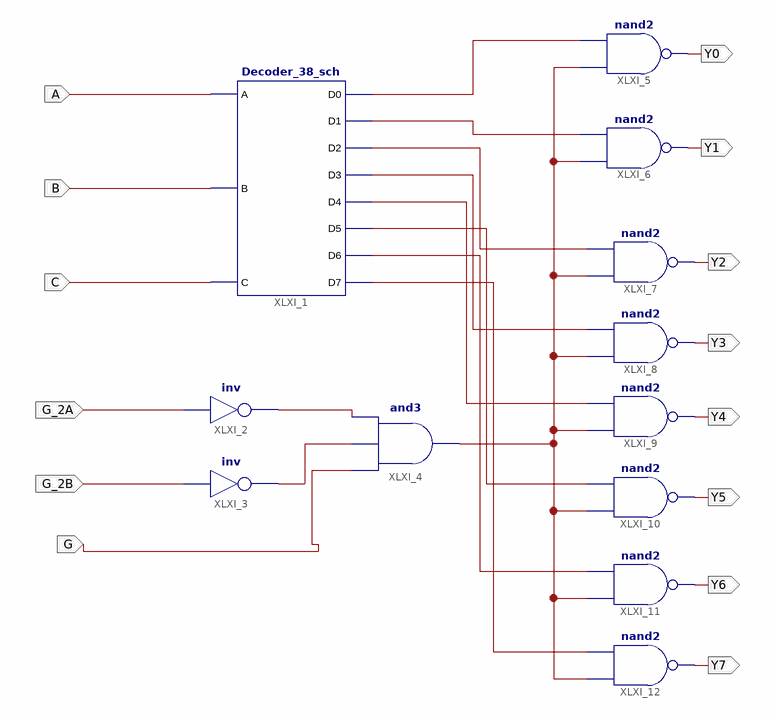
[diagram p0: schematic sheet 1]
// Xilinx ISE schematic HCT138.sch (kintex7) as structural Verilog: 12 symbols, 14 ports
module HCT138 (
  input  A,
  input  B,
  input  C,
  input  G_2A,
  input  G_2B,
  input  G,
  output Y0,
  output Y1,
  output Y2,
  output Y3,
  output Y4,
  output Y5,
  output Y6,
  output Y7
);

  wire XLXN_9, XLXN_10, XLXN_12, XLXN_13, XLXN_14, XLXN_15, XLXN_16, XLXN_17, XLXN_18, XLXN_19, XLXN_20;

  Decoder_38_sch XLXI_1 (
    .A(A), .B(B), .C(C), .D0(XLXN_13), .D1(XLXN_14), .D2(XLXN_15), .D3(XLXN_16), .D4(XLXN_17), .D5(XLXN_18),
    .D6(XLXN_19), .D7(XLXN_20));
  not XLXI_2 (XLXN_9, G_2A);
  not XLXI_3 (XLXN_10, G_2B);
  and XLXI_4 (XLXN_12, G, XLXN_10, XLXN_9);
  nand XLXI_5 (Y0, XLXN_12, XLXN_13);
  nand XLXI_6 (Y1, XLXN_12, XLXN_14);
  nand XLXI_7 (Y2, XLXN_12, XLXN_15);
  nand XLXI_8 (Y3, XLXN_12, XLXN_16);
  nand XLXI_9 (Y4, XLXN_12, XLXN_17);
  nand XLXI_10 (Y5, XLXN_12, XLXN_18);
  nand XLXI_11 (Y6, XLXN_12, XLXN_19);
  nand XLXI_12 (Y7, XLXN_12, XLXN_20);
endmodule
